# Altium schematic sheet USB-TYPEC_CON.SchDoc: USB-TYPEC_CON
size A4; Date: Not used; ApprovedBy: Not used; CheckedBy: Not used; Author: Not used; CompanyName: STMicroelectronics; DrawnBy: Not used; Engineer: Not used; Organization: Not used; Address1: Not used; Address2: Not used; Address3: Not used; Address4: Not used; DocumentNumber: Not used; Revision: Not used; SheetNumber: 6; SheetTotal: 22; CurrentTime: Not used; CurrentDate: Not used; Time: Not used; DocumentFullPathAndName: Not used; DocumentName: Not used; ModifiedDate: Not used; ImagePath: Not used; ProjectName: Not used; Application_BuildNumber: Not used
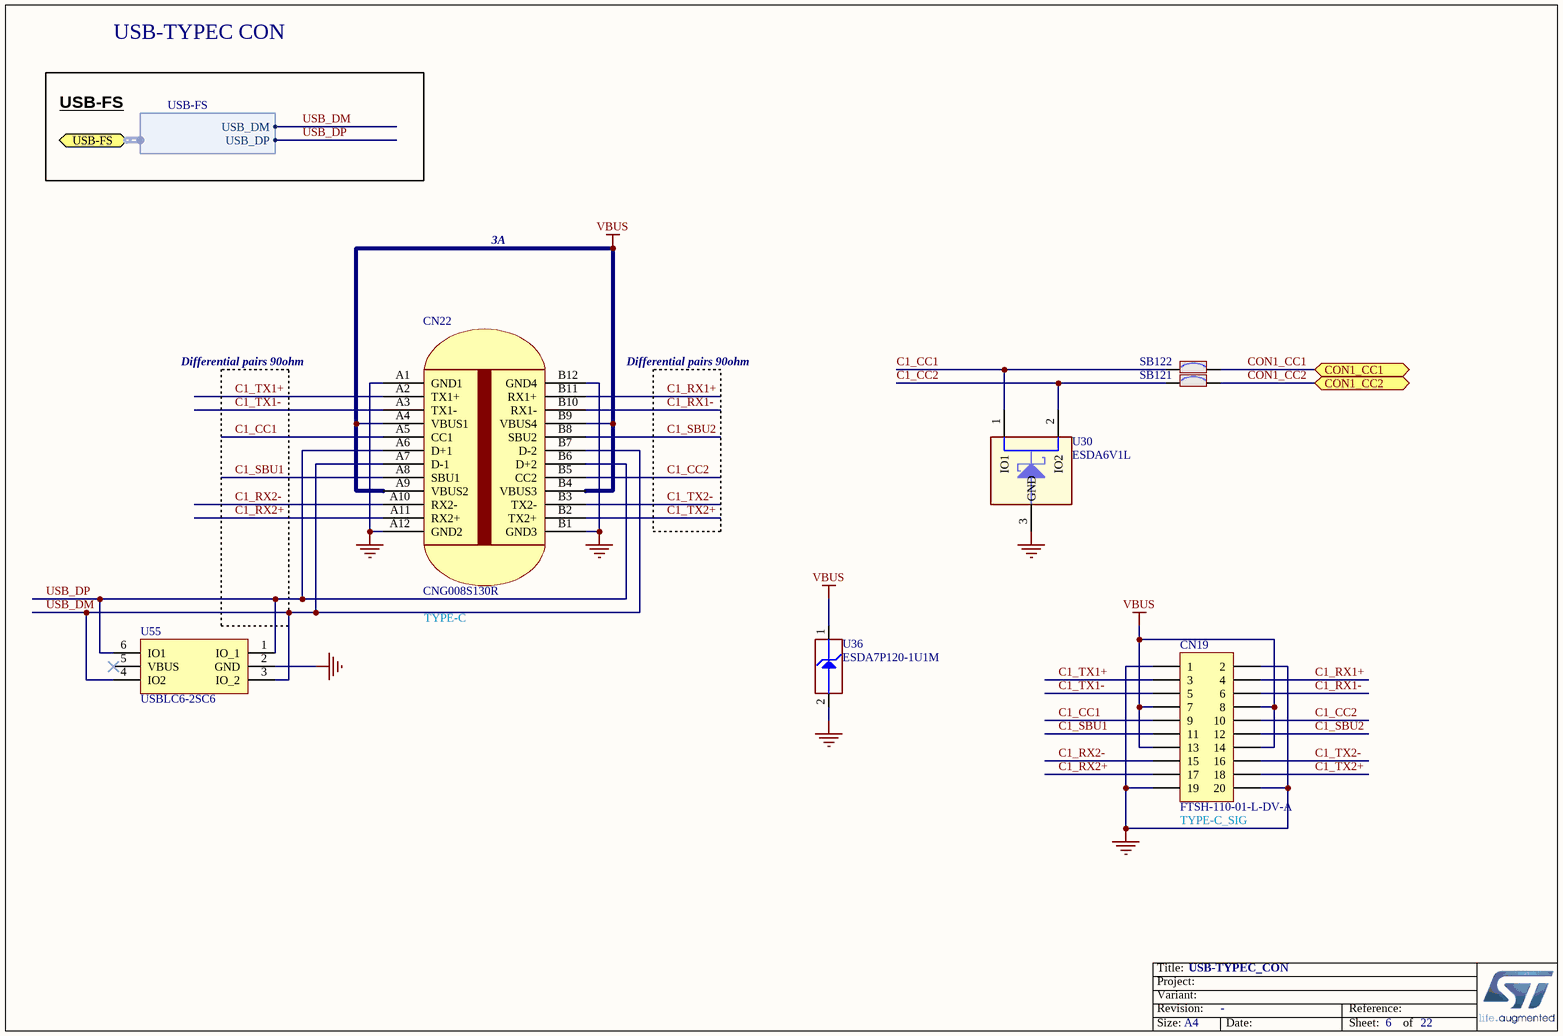
[diagram p0: USB-TYPEC_CON.SchDoc]

## Parts
CN19  value FTSH-110-01-L-DV-A  [CON_SAMTEC_FTSH-110-01-L-DV-A]  (hidden comment: Header 10x2)
CN22  value CNG008S130R  [CON_USB-TYPEC_LITKCONN-TECHNOLOGY_CNG008S130R]  (hidden comment: USB Type-C)
SB121  SB_ON  [SOLDER-BRIDGE_R0603-0R]  (value not drawn)
SB122  SB_ON  [SOLDER-BRIDGE_R0603-0R]  (value not drawn)
U30  value ESDA6V1L  [ESD_SOT23]  (hidden comment: ESDAxxL)
U36  value ESDA7P120-1U1M  [ESD_QFN1610_2N_1K_2A]  (hidden comment: ESD-TRANSIL)
U55  USBLC6-2SC6  [ESD_SOT23-6L]

## Ports
CON1_CC1, CON1_CC2, USB-FS (harness USB-FS)

## Harnesses
USB-FS: USB_DM, USB_DP

## Nets
GND: CN19.1 CN19.2 CN19.19 CN19.20 CN22.A1(GND1) CN22.A12(GND2) CN22.B1(GND3) CN22.B12(GND4) U30.3(GND) U36.2(GND) U55.2(GND)
VBUS: CN19.7 CN19.8 CN19.13 CN19.14 CN22.A4(VBUS1) CN22.A9(VBUS2) CN22.B4(VBUS3) CN22.B9(VBUS4) U36.1(IO1)
C1_CC1: CN19.9 CN22.A5(CC1) SB122.1 U30.1(IO1)
C1_CC2: CN19.10 CN22.B5(CC2) SB121.1 U30.2(IO2)
C1_RX1+: CN19.4 CN22.B11(RX1+)
C1_RX1-: CN19.6 CN22.B10(RX1-)
C1_RX2+: CN19.17 CN22.A11(RX2+)
C1_RX2-: CN19.15 CN22.A10(RX2-)
C1_SBU1: CN19.11 CN22.A8(SBU1)
C1_SBU2: CN19.12 CN22.B8(SBU2)
C1_TX1+: CN19.3 CN22.A2(TX1+)
C1_TX1-: CN19.5 CN22.A3(TX1-)
C1_TX2+: CN19.18 CN22.B2(TX2+)
C1_TX2-: CN19.16 CN22.B3(TX2-)
CON1_CC1: SB122.2 ; port CON1_CC1
CON1_CC2: SB121.2 ; port CON1_CC2
USB_DM: CN22.A7(D-1) CN22.B7(D-2) U55.3(IO_2) U55.4(IO2) ; port USB-FS.USB_DM
USB_DP: CN22.A6(D+1) CN22.B6(D+2) U55.1(IO_1) U55.6(IO1) ; port USB-FS.USB_DP

Not connected (* = marked no-connect by the designer): U55 5(VBUS)*

## Notes on the sheet
- USB-TYPEC CON
- USB-FS
- 3A
- Differential pairs 90ohm
- TYPE-C
- (near CN19) TYPE-C_SIG
- Title:
- Project:
- Size:
- Revision:
- Variant:
- A4
- -
- Date:
- Reference:
- Sheet:
- of

## Library data of the parts
CN19 = MCD-01561: Header 10x2, 1.27mm, VR, CMS, Height 3.05mm with alignment pin; Part_Type: Connector; Manufacturer: SAMTEC; Provided_By: SUBCO; Initial_Board_Reference: MB1397; Path: ws/MCD_ApplicationBoards/Lists/MCDPARTSdatabase; Item Type: Item; Remark: new part FTSH-110-01-L-DV-A to replace MCD-00557 footprint; Internal_Part_Number: MCD-01561; Status: New; Manufacturer_Part_Number: FTSH-110-01-L-DV-A; ComponentLink1Description: Datasheet; ComponentLink1URL: http://tunmcdsvn.tun.st.com/Component_Datasheet_Library/Trunk/Connectors/Samtec_FTSH_smt_series
CN22 = MCD-00678: USB Type C certified Connector SMT Mid-mount; Manufacturer: LITKCON TECHNOLOGY; Provided_By: SUBCO; Initial_Board_Reference: MB1272; Path: ws/MCD_ApplicationBoards/Lists/MCDPARTSdatabase; Item Type: Item; Internal_Part_Number: MCD-00678; Status: Footprint available; Part_Type: Connector; Manufacturer_Part_Number: CNG008S130R; ComponentLink1Description: Datasheet; ComponentLink1URL: http://tunmcdsvn.tun.st.com/Component_Datasheet_Library/Trunk/Connectors/LITKCON TECHNOLOGY_USBTypeC_CNG008S130R
SB121 SB122 = MCD-00071: Solder Bridge ON; Part_Type: Mechanical; Manufacturer_Part_Number: RC0603JR-070RL; Manufacturer: YAGEO; Provided_By: SUBCO; Initial_Board_Reference: MB1274; Path: ws/MCD_ApplicationBoards/Lists/MCDPARTSdatabase; Item Type: Item; Internal_Part_Number: MCD-00071; Status: Released; ComponentLink1Description: Datasheet; Package: SB0603; ComponentLink1URL: http://tunmcdsvn.tun.st.com/Component_Datasheet_Library/Trunk/Resistors/Yageo_Resistor_RC0603-series
U30 = MCD-00255: Dual Transil array ESD protection; Part_Type: Diode; Manufacturer: STMICROELECTRONICS; BMS_Part_Number: 9179033; Provided_By: SUBCO with ST control; Initial_Board_Reference: MB1311; Path: ws/MCD_ApplicationBoards/Lists/MCDPARTSdatabase; Item Type: Item; Internal_Part_Number: MCD-00255; Status: Released; Manufacturer_Part_Number: ESDA6V1L; ComponentLink1Description: Datasheet; ComponentLink1URL: http://tunmcdsvn.tun.st.com/Component_Datasheet_Library/Trunk/Diodes/STM_ESD_ESDAxxL
U36 = MCD-01026: High power transient voltage suppressor; Part_Type: Diode; Manufacturer: STMICROELECTRONICS; BMS_Part_Number: 9179046; Provided_By: SUBCO with ST control; Initial_Board_Reference: MB1378; Remark: Footprint moved fromROU lib: DFN105P160X60-2N to global-lib: ESD_QFN1610_2N_1K_2A; Path: ws/MCD_ApplicationBoards/Lists/MCDPARTSdatabase; Item Type: Item; Internal_Part_Number: MCD-01026; Status: Released; Manufacturer_Part_Number: ESDA7P120-1U1M; Package: QFN1610; ComponentLink1Description: Datasheet; ComponentLink1URL: http://tunmcdsvn.tun.st.com/Component_Datasheet_Library/Trunk/Diodes/STM_ESD_ESDA7P120-1U1M
U55 = MCD-00163: Very low capacitance ESD protection; Part_Type: IC; Manufacturer: STMICROELECTRONICS; BMS_Part_Number: 9151075; Provided_By: SUBCO with ST control; Initial_Board_Reference: MB1263; Path: ws/MCD_ApplicationBoards/Lists/MCDPARTSdatabase; Item Type: Item; Internal_Part_Number: MCD-00163; Value: USBLC6-2SC6; Status: Released; Manufacturer_Part_Number: USBLC6-2SC6; ComponentLink1Description: Datasheet; ComponentLink1URL: http://tunmcdsvn.tun.st.com/Component_Datasheet_Library/Trunk/Diodes/STM_ESD_USBLC6-2